# Altium schematic sheet avroscope.SchDoc: AVROscope Schematics
size A; Author: Nima Alamatsaz; DrawnBy: Nima Alamatsaz; Engineer: Nima Alamatsaz; DocumentName: AVROscope Schematics; ProjectName: AVROscope
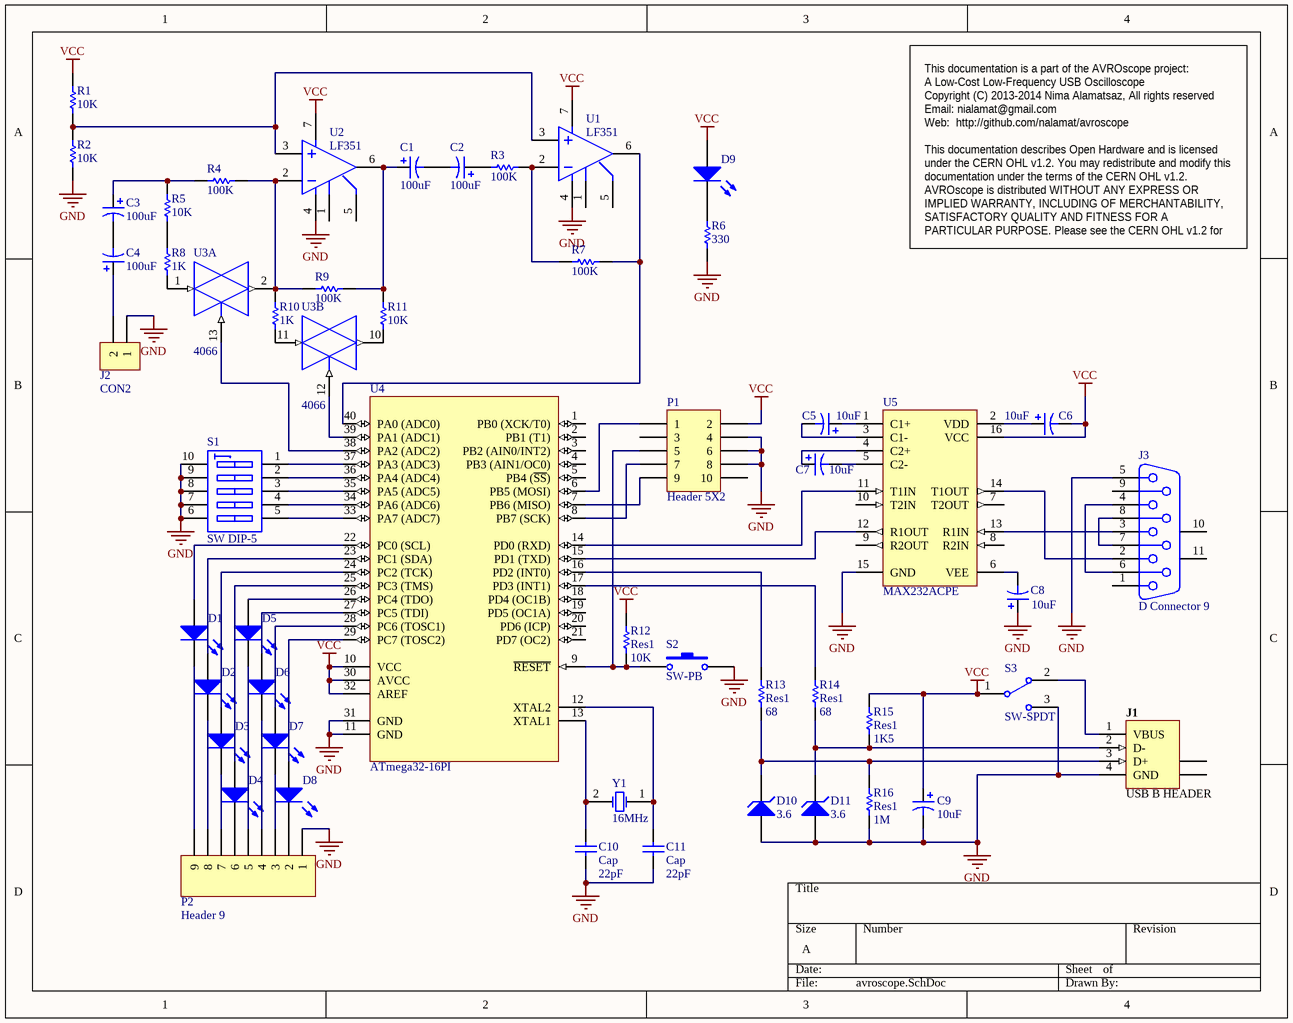
[diagram p0: avroscope.SchDoc]

## Parts
C1  value 100uF  [RB.1/.2]  (hidden comment: Cap Pol1)
C2  value 100uF  [RB.1/.2]  (hidden comment: Cap Pol1)
C3  value 100uF  [RB.1/.2]  (hidden comment: Cap Pol1)
C4  value 100uF  [RB.1/.2]  (hidden comment: Cap Pol1)
C5  value 10uF  [RB.1/.2]  (hidden comment: Cap Pol1)
C6  value 10uF  [RB.1/.2]  (hidden comment: Cap Pol1)
C7  value 10uF  [RB.1/.2]  (hidden comment: Cap Pol1)
C8  value 10uF  [RB.1/.2]  (hidden comment: Cap Pol1)
C9  value 10uF  [RB.1/.2]  (hidden comment: Cap Pol1)
C10  Cap  value 22pF  [RAD0.1]
C11  Cap  value 22pF  [RAD0.1]
D1  LED1  [LED .1]  (value not drawn)
D2  LED1  [LED .1]  (value not drawn)
D3  LED1  [LED .1]  (value not drawn)
D4  LED1  [LED .1]  (value not drawn)
D5  LED1  [LED .1]  (value not drawn)
D6  LED1  [LED .1]  (value not drawn)
D7  LED1  [LED .1]  (value not drawn)
D8  LED1  [LED .1]  (value not drawn)
D9  LED1  [LED .1]  (value not drawn)
D10  3.6  [Diode .3 .03]
D11  3.6  [Diode .3 .03]
J1  USB B HEADER  [USB-B]
J2  CON2  [Header2 .2 .055]
J3  D Connector 9  [DB9]
P1  Header 5X2  [ISP]
P2  Header 9  [SIL.1/9]
R1  value 10K  [AXIAL0.4]  (hidden comment: Res1)
R2  value 10K  [AXIAL0.4]  (hidden comment: Res1)
R3  value 100K  [AXIAL0.4]  (hidden comment: Res1)
R4  value 100K  [AXIAL0.4]  (hidden comment: Res1)
R5  value 10K  [AXIAL0.4]  (hidden comment: Res1)
R6  value 330  [AXIAL0.4]  (hidden comment: Res1)
R7  value 100K  [AXIAL0.4]  (hidden comment: Res1)
R8  value 1K  [AXIAL0.4]  (hidden comment: Res1)
R9  value 100K  [AXIAL0.4]  (hidden comment: Res1)
R10  value 1K  [AXIAL0.4]  (hidden comment: Res1)
R11  value 10K  [AXIAL0.4]  (hidden comment: Res1)
R12  Res1  value 10K  [AXIAL0.4]
R13  Res1  value 68  [AXIAL0.4]
R14  Res1  value 68  [AXIAL0.4]
R15  Res1  value 1K5  [AXIAL0.4]
R16  Res1  value 1M  [AXIAL0.4]
S1  SW DIP-5  [DIP10e]
S2  SW-PB  [SIP2]
S3  SW-SPDT  [SW DPDT]
U1  LF351  [DIP8e]
U2  LF351  [DIP8e]
U3  4066  [DIP14e]  (parts A,B of 4)
U4  ATmega32-16PI  [DIP40E-600]
U5  MAX232ACPE  [DIP16e]
Y1  16MHz  [XTAL1]

## Nets
GND: C8.1 C9.2 C10.1 C11.1 D10.1(A) D11.1(A) J1.4(GND) J2.1 J3.5 P1.4 P1.6 P1.8 P2.1 R2.1 R6.1 R16.1 S1.6(B5) S1.7(B4) S1.8(B3) S1.9(B2) S1.10(B1) S2.2 S3.3 U1.4 U2.4 U3.7(GND) U4.11(GND) U4.31(GND) U5.15(GND)
VCC: C6.2 C9.1 D9.1(A) P1.2 R1.2 R12.1 R15.2 S3.1 U1.7 U2.7 U3.14(VCC) U4.10(VCC) U4.30(AVCC) U4.32(AREF) U5.16(VCC)
NetC1_1: C1.1 R9.2 R11.2 U2.6
NetC1_2: C1.2 C2.2
NetC2_1: C2.1 R3.1
NetC3_1: C3.1 R4.1 R5.2
NetC3_2: C3.2 C4.2
NetC4_1: C4.1 J2.2
NetC5_1: C5.1 U5.1(C1+)
NetC5_2: C5.2 U5.3(C1-)
NetC6_1: C6.1 U5.2(VDD)
NetC7_1: C7.1 U5.4(C2+)
NetC7_2: C7.2 U5.5(C2-)
NetC8_2: C8.2 U5.6(VEE)
NetC10_2: C10.2 U4.13(XTAL1) Y1.2(OSC2)
NetC11_2: C11.2 U4.12(XTAL2) Y1.1(OSC1)
NetD1_1: D1.1(A) U4.22(PC0_(SCL))
NetD1_2: D1.2(K) P2.9
NetD2_1: D2.1(A) U4.23(PC1_(SDA))
NetD2_2: D2.2(K) P2.8
NetD3_1: D3.1(A) U4.24(PC2_(TCK))
NetD3_2: D3.2(K) P2.7
NetD4_1: D4.1(A) U4.25(PC3_(TMS))
NetD4_2: D4.2(K) P2.6
NetD5_1: D5.1(A) U4.26(PC4_(TDO))
NetD5_2: D5.2(K) P2.5
NetD6_1: D6.1(A) U4.27(PC5_(TDI))
NetD6_2: D6.2(K) P2.4
NetD7_1: D7.1(A) U4.28(PC6_(TOSC1))
NetD7_2: D7.2(K) P2.3
NetD8_1: D8.1(A) U4.29(PC7_(TOSC2))
NetD8_2: D8.2(K) P2.2
NetD9_2: D9.2(K) R6.2
NetD10_2: D10.2(K) J1.3(D+) R13.1 R16.2
NetD11_2: D11.2(K) J1.2(D-) R14.1 R15.1
NetJ1_1: J1.1(VBUS) S3.2
NetJ3_2: J3.2 U5.14(T1OUT)
NetJ3_3: J3.3 U5.13(R1IN)
NetJ3_4: J3.4 J3.6
NetJ3_7: J3.7 J3.8
NetP1_1: P1.1 U4.6(PB5_(MOSI))
NetP1_5: P1.5 R12.2 S2.1 U4.9(~{RESET})
NetP1_7: P1.7 U4.8(PB7_(SCK))
NetP1_9: P1.9 U4.7(PB6_(MISO))
NetR1_1: R1.1 R2.2 U1.3 U2.3
NetR3_2: R3.2 R7.1 U1.2
NetR4_2: R4.2 R9.1 R10.2 U2.2 U3.2
NetR5_1: R5.1 R8.2
NetR7_2: R7.2 U1.6 U4.40(PA0_(ADC0))
NetR8_1: R8.1 U3.1
NetR10_1: R10.1 U3.11
NetR11_1: R11.1 U3.10
NetR13_2: R13.2 U4.16(PD2_(INT0))
NetR14_2: R14.2 U4.17(PD3_(INT1))
NetS1_1: S1.1(A1) U4.37(PA3_(ADC3))
NetS1_2: S1.2(A2) U4.36(PA4_(ADC4))
NetS1_3: S1.3(A3) U4.35(PA5_(ADC5))
NetS1_4: S1.4(A4) U4.34(PA6_(ADC6))
NetS1_5: S1.5(A5) U4.33(PA7_(ADC7))
NetU3_12: U3.12 U4.39(PA1_(ADC1))
NetU3_13: U3.13 U4.38(PA2_(ADC2))
NetU4_14: U4.14(PD0_(RXD)) U5.11(T1IN)
NetU4_15: U4.15(PD1_(TXD)) U5.12(R1OUT)

Not connected (* = marked no-connect by the designer): J1 5(SHLD) 6(SHLD); J3 1 9 10(MH1) 11(MH2); P1 3 10; U1 1 5; U2 1 5; U4 1(PB0_(XCK/T0)) 2(PB1_(T1)) 3(PB2_(AIN0/INT2)) 4(PB3_(AIN1/OC0)) 5(PB4_(~{SS})) 18(PD4_(OC1B)) 19(PD5_(OC1A)) 20(PD6_(ICP)) 21(PD7_(OC2)); U5 7(T2OUT) 8(R2IN) 9(R2OUT) 10(T2IN)

## Notes on the sheet
- This documentation is a part of the AVROscope project:
  A Low-Cost Low-Frequency USB Oscilloscope
  Copyright (C) 2013-2014 Nima Alamatsaz, All rights reserved
  Email: nialamat@gmail.com
  Web:  http://github.com/nalamat/avroscope
  This documentation describes Open Hardware and is licensed under the CERN OHL v1.2. You may redistribute and modify this documentation under the terms of the CERN OHL v1.2. AVROscope is distributed WITHOUT ANY EXPRESS OR IMPLIED WARRANTY, INCLUDING OF MERCHANTABILITY, SATISFACTORY QUALITY AND FITNESS FOR A PARTICULAR PURPOSE. Please see the CERN OHL v1.2 for applicable conditions. (http://ohwr.org/CERNOHL)

## Library data of the parts
C1-C9 = Cap Pol1: Polarized Capacitor (Radial); Published: 8-Jun-2000; LatestRevisionDate: 17-Jul-2002; LatestRevisionNote: Re-released for DXP Platform.; PackageReference: RB7.6-15; Publisher: Altium Limited
C10 C11 = Cap: Capacitor; Published: 8-Jun-2000; LatestRevisionDate: 17-Jul-2002; LatestRevisionNote: Re-released for DXP Platform.; PackageReference: RAD-0.3; Publisher: Altium Limited
D1-D9 = LED1: Typical RED GaAs LED; Published: 8-Jun-2000; LatestRevisionDate: 08-Jul-2005; LatestRevisionNote: Mech Layer 1 removed.; PackageReference: LED-1; Publisher: Altium Limited
D10 D11 = D Zener: Zener Diode; Published: 8-Jun-2000; LatestRevisionDate: 17-Jul-2002; LatestRevisionNote: Re-released for DXP Platform.; PackageReference: DIODE-0.7; Publisher: Altium Limited
J1 = D-300-0000: Connector, USB B Type, Right Angle, Thru Hole, White; Max Current: mA; Category: Connector; Connector type: Header; Mounting Technology: Through-Hole; Pin Count: 4; Status: Production
J2 = CON2: Connector
J3 = D Connector 9: Receptacle Assembly, 9 Position, Right Angle; Package Information: Latest Revision: O; Positions: 9; Published: 15-Jun-2001; Revision: 17-Jul-2002: Re-released for DXP Platform.; Datasheet: (1-Sep-1999); Package Reference: 788750; Publisher: Altium Limited; Orientation: Right Angle; Gender: Receptacle
P1 = Header 5X2: Header, 5-Pin, Dual row; LatestRevisionDate: 17-Jul-2002; LatestRevisionNote: Re-released for DXP Platform.; Publisher: Altium Limited
P2 = Header 9: Header, 9-Pin; LatestRevisionDate: 17-Jul-2002; LatestRevisionNote: Re-released for DXP Platform.; Publisher: Altium Limited
R1-R16 = Res1: Resistor; Published: 8-Jun-2000; LatestRevisionDate: 17-Jul-2002; LatestRevisionNote: Re-released for DXP Platform.; PackageReference: AXIAL-0.3; Publisher: Altium Limited
S1 = SW DIP-5: DIP Switch, 5 Position, SPST; Published: 24-Mar-1999; LatestRevisionDate: 17-Jul-2002; LatestRevisionNote: Re-released for DXP Platform.; PackageReference: N10A; Publisher: Altium Limited
S2 = SW-PB: Switch; Published: 24-Mar-1999; LatestRevisionDate: 17-Jul-2002; LatestRevisionNote: Re-released for DXP Platform.; PackageReference: SPST-2; Publisher: Altium Limited
S3 = SW-SPDT: SPDT Subminiature Toggle Switch, Right Angle Mounting, Vertical Actuation; Revision 1: Jul-2002: Re-released for DXP Platform.; Revision 2: 17-Dec-2003: Schematic revised, PCB Footprint replaced.; Published: 24-Mar-1999; Datasheet: Latest Revision: 05-Dec-2000; Publisher: Altium Limited
U1 U2 = 741
U4 = ATmega32-16PI: 8-Bit AVR Microcontroller with 32K Bytes of In-System Programmable Flash Memory; Published: 17-Sep-2003; LatestRevisionDate: 04-Mar-2005; LatestRevisionNote: Stylized 3D Model Added.; DatasheetVersion: 2503C-AVR-10/02; PackageVersion: Dec-1999; PackageReference: 40P6; Publisher: Altium Limited; PackageDescription: DIP; 40 Leads; Row Spacing 15.24 mm; Pitch 2.54 mm; ComponentLink1Description: Manufacturer Link; ComponentLink1URL: http://www.atmel.com; ComponentLink2Description: Datasheet; ComponentLink2URL: http://www.atmel.com/dyn/resources/prod_documents/doc2503.pdf
U5 = MAX232ACPE: +5V Powered, Multi-Channel RS-232 Driver/Receiver; Published: 16-Jan-2001; LatestRevisionDate: 29-May-2009; LatestRevisionNote: Component Body Added.; PackageVersion: 1997; PackageReference: PE16A; Publisher: Altium Limited; PackageDescription: DIP, 16-Pin, Row Spacing 7.62 mm, Pitch 2.54 mm; Code_JEDEC: MS-001-BB; ComponentLink1Description: Manufacturer Link; ComponentLink1URL: http://www.maxim-ic.com/; ComponentLink2Description: Datasheet; ComponentLink2URL: http://pdfserv.maxim-ic.com/en/ds/MAX220-MAX249.pdf
Y1 = XTAL: Crystal Oscillator; Published: 8-Jun-2000; LatestRevisionDate: 17-Jul-2002; LatestRevisionNote: Re-released for DXP Platform.; PackageReference: R38; Publisher: Altium Limited